# Altium schematic sheet 3_03 Power.SchDoc.schdoc
size 497 x 243 mm; Name: A_A4; Symbol: A_A4; Device: A_A4; @Project Name: 03 Power.SchDoc; REV: 1.0; Date: 2024-05-14; Sheet: 1/1; Draw By: TheConquerK; Company: NEU-REAL-LAB; Convert to PCB: yes; Add into BOM: yes
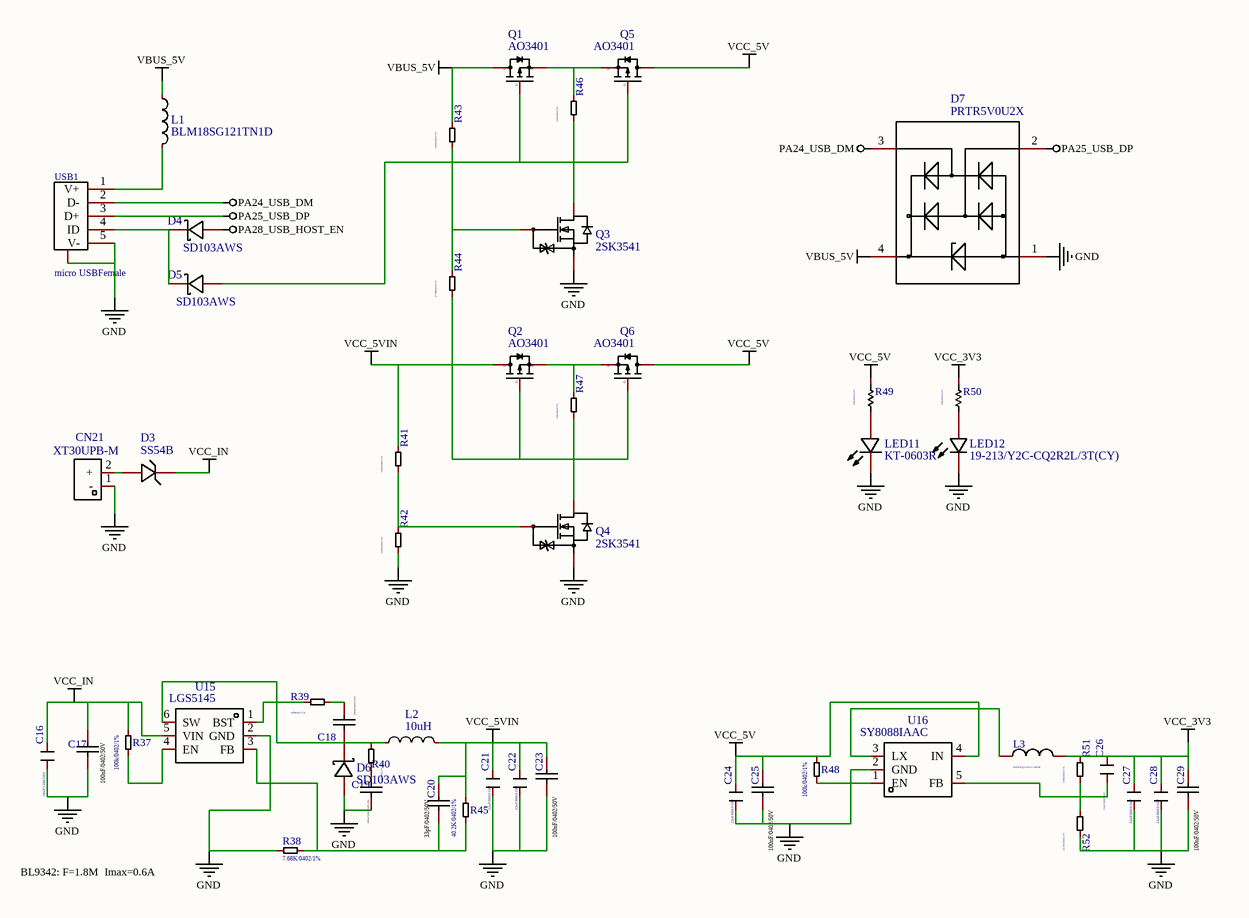
[diagram p0: 3_03 Power.SchDoc.schdoc]

## Parts
C16  10uF/1206/50V  [C1206]
C17  100nF/0603/50V  [C0402]  (value not drawn)
C18  100nF/0603/50V  [C0402]  (value not drawn)
C19  100nF/0603/50V  [C0402]  (value not drawn)
C20  100nF/0603/50V  [R0402]  (value not drawn)
C21  22uF/0603/10V  [C0603]
C22  22uF/0603/10V  [C0603]
C23  100nF/0603/50V  [C0402]  (value not drawn)
C24  22uF/0603/10V  [C0603]
C25  100nF/0603/50V  [C0402]  (value not drawn)
C26  22pF/0402/50V  [C0402]
C27  22uF/0603/10V  [C0603]
C28  22uF/0603/10V  [C0603]
C29  100nF/0603/50V  [C0402]  (value not drawn)
CN21  XT30UPB-M  [CONN-TH_XT30UPB-M]
D3  SS54B  [DO-214BA_L4.8-W2.9-LS5.3-RD]
D4  SD103AWS  [SOD-323_L1.8-W1.3-LS2.5-RD]
D5  SD103AWS  [SOD-323_L1.8-W1.3-LS2.5-RD]
D6  SD103AWS  [SOD-323_L1.8-W1.3-LS2.5-RD]
D7  PRTR5V0U2X  [SOT-143_L2.9-W1.3-P1.92-LS2.3-BL]
L1  BLM18SG121TN1D  [L0603]
L2  10uH  [L1008]
L3  PSPNAQ252012-2R2M  [L2520]
LED11  KT-0603R  [LED0603-RD]
LED12  19-213/Y2C-CQ2R2L/3T(CY)  [LED0603-RD-YELLOW]
Q1  AO3401  [SOT-23-3_L2.9-W1.3-P1.90-LS2.4-BR]
Q2  AO3401  [SOT-23-3_L2.9-W1.3-P1.90-LS2.4-BR]
Q3  2SK3541  [SOT-723_L1.2-W0.8-P0.40-LS1.2-BR]
Q4  2SK3541  [SOT-723_L1.2-W0.8-P0.40-LS1.2-BR]
Q5  AO3401  [SOT-23-3_L2.9-W1.3-P1.90-LS2.4-BR]
Q6  AO3401  [SOT-23-3_L2.9-W1.3-P1.90-LS2.4-BR]
R37  100k/0402/1%  [R0402]
R38  7.68K/0402/1%  [R0402]
R39  10R/0402/1%  [R0402]
R40  10R/0402/1%-NC  [R0402]
R41  100k/0402/1%  [R0402]
R42  100k/0402/1%  [R0402]
R43  100k/0402/1%  [R0402]
R44  470R/0402/1%  [R0402]
R45  40.2K/0402/1%  [R0402]
R46  10k/0402/1%  [R0402]
R47  10k/0402/1%  [R0402]
R48  100k/0402/1%  [R0402]
R49  10K/0402/1%  [R0402]
R50  10K/0402/1%  [R0402]
R51  100k/0402/1%  [R0402]
R52  22.1K/0402/1%  [R0402]
U15  LGS5145  [SOT-23-6_L2.9-W1.7-P0.95-LS2.8-BL]
U16  SY8088IAAC  [SOT-23-5_L3.0-W1.7-P0.95-LS2.8-BL]
USB1  micro USBFemale  [MICRO-USB-SMD_5P-P0.65-H-F_C10418]

## Nets
GND: C16.1 C17.1 C19.1 C21.1 C22.1 C23.1 C24.1 C25.1 C27.1 C28.1 C29.1 CN21.1(-) D6.2(A) D7.1(GND) LED11.1(K) LED12.1(C) Q3.2(S) Q4.2(S) R38.2 R42.1 R52.1 U15.2(GND) U16.2(GND) USB1.5(MTN)
PA24_USB_DM: D7.3(IO2) USB1.2(D-)
PA25_USB_DP: D7.2(IO1) USB1.3(D+)
PA28_USB_HOST_EN: D4.2(A)
VBUS_5V: D7.4(VCC) L1.1 Q1.3(D) R43.2
VCC_3V3: C26.2 C27.2 C28.2 C29.2 L3.2 R50.2 R51.2
VCC_5V: C24.2 C25.2 Q5.3(D) Q6.3(D) R48.2 R49.2 U16.4(IN)
VCC_5VIN: C20.2 C21.2 C22.2 C23.2 L2.2 Q2.3(D) R41.2 R45.2
VCC_IN: C16.2 C17.2 D3.1(C) R37.2 U15.5(VIN)
NetC18_1: C18.1 D6.1(K) L2.1 R40.2 U15.6(SW)
NetC18_2: C18.2 R39.2
NetC19_2: C19.2 R40.1
NetC20_1: C20.1 R38.1 R45.1 U15.3(FB)
NetC26_1: C26.1 R51.1 R52.2 U16.5(FB)
NetCN21_2: CN21.2(+) D3.2(A)
NetD4_1: D4.1(K) D5.1(K) USB1.4(ID)
NetD5_2: D5.2(A) Q1.1(G) Q3.3(D) Q5.1(G) R46.1
NetL1_2: L1.2 USB1.1(V+)
NetL3_1: L3.1 U16.3(LX)
NetLED11_2: LED11.2(A) R49.1
NetLED12_2: LED12.2(A) R50.1
NetQ1_2: Q1.2(S) Q5.2(S) R46.2
NetQ2_1: Q2.1(G) Q4.3(D) Q6.1(G) R44.1 R47.1
NetQ2_2: Q2.2(S) Q6.2(S) R47.2
NetQ3_1: Q3.1(G) R43.1 R44.2
NetQ4_1: Q4.1(G) R41.1 R42.2
NetR37_1: R37.1 U15.4(EN)
NetR39_1: R39.1 U15.1(BST)
NetR48_1: R48.1 U16.1(EN)

## Notes on the sheet
- BL9342: F=1.8M  Imax=0.6A
- 1
- 2
- 3
- 4
- 5
- A
- B
- C
- D
- TITLE:
- 03 Power.SchDoc
- REV:
- 1.0
- Date:
- Company:
- 2024-05-14
- NEU-REAL-LAB
- Drawn By:
- TheConquerK
- Sheet:
- 1/1
- (in symbol 100nF/0603/50V) 100nF/0402/50V; 100nF/0402/50V-NC; 33pF/0402/50V

## Library data of the parts
C16 = 10uF/1206/50V: Convert to PCB: yes; Name: 10uF/1206/50V; Symbol: 10uF/1206/50V; Device: 10uF/1206/50V; Add into BOM: yes; Origin Footprint: C1206
C17-C20 C23 C25 C29 = 100nF/0603/50V: Convert to PCB: yes; Name: 100nF/0603/50V; Symbol: 100nF/0603/50V; Device: 100nF/0603/50V; Published: 8-Jun-2000; LatestRevisionDate: 17-Jul-2002; LatestRevisionNote: Re-released for DXP Platform.; PackageReference: RAD-0.3; Publisher: Altium Limited; PackageDescription: Radial Cap, Thru-Hole; 2 Leads; 0.3 in Pin Spacing; Add into BOM: yes
  C17-C19 C23 C25 C29: Origin Footprint: C0402
  C20: Origin Footprint: R0402
C21 C22 C24 C27 C28 = 22uF/0603/10V: Convert to PCB: yes; Name: 22uF/0603/10V; Symbol: 22uF/0603/10V; Device: 22uF/0603/10V; Add into BOM: yes; Origin Footprint: C0603
C26 = 22pF/0402/50V: Convert to PCB: yes; Name: 22pF/0402/50V; Symbol: 22pF/0402/50V; Device: 22pF/0402/50V; Add into BOM: yes; Origin Footprint: C0402
CN21 = XT30UPB-M: Manufacturer: AMASS(艾迈斯); Convert to PCB: yes; Name: XT30UPB-M; Symbol: XT30UPB-M; Device: XT30UPB-M; Supplier: LCSC; Supplier Part: C428721; Manufacturer Part: XT30UPB-M; JLCPCB Part Class: Extended Part; Add into BOM: yes; Origin Footprint: CONN-TH_XT30UPB-M
D3 = SS54B: Manufacturer: PINGWEI(平伟); Convert to PCB: yes; Name: SS54B; Symbol: SS54B; Device: SS54B; Supplier: LCSC; Supplier Part: C360458; Manufacturer Part: SS54B; JLCPCB Part Class: Extended Part; Add into BOM: yes; Origin Footprint: DO-214BA_L4.8-W2.9-LS5.3-RD
D4-D6 = SD103AWS: Manufacturer: 星海; Convert to PCB: yes; Name: SD103AWS; Symbol: SD103AWS; Device: SD103AWS; Supplier: LCSC; Supplier Part: C146260; Manufacturer Part: SD103AWS; JLCPCB Part Class: Extended Part; Add into BOM: yes; Origin Footprint: SOD-323_L1.8-W1.3-LS2.5-RD
D7 = PRTR5V0U2X: Manufacturer: Yenji Elec; Convert to PCB: yes; Name: PRTR5V0U2X; Symbol: PRTR5V0U2X; Device: PRTR5V0U2X; Supplier: LCSC; Supplier Part: C330092; Manufacturer Part: PRTR5V0U2X; Add into BOM: yes; Origin Footprint: SOT-143_L2.9-W1.3-P1.92-LS2.3-BL
L1 = BLM18SG121TN1D: Manufacturer: muRata(村田); Convert to PCB: yes; Name: BLM18SG121TN1D; Symbol: BLM18SG121TN1D; Device: BLM18SG121TN1D; Supplier: LCSC; Supplier Part: C113030; Manufacturer Part: BLM18SG121TN1D; JLCPCB Part Class: Extended Part; Add into BOM: yes; Origin Footprint: L0603
L2 = 10uH: Manufacturer: Sunlord(顺络); Manufacturer Part: MPL2520S100MWT; Convert to PCB: yes; Name: 10uH; Symbol: 10uH; Device: 10uH; Supplier: LCSC; Supplier Part: C370039; JLCPCB Part Class: Extended Part; Add into BOM: yes; Origin Footprint: L1008
L3 = PSPNAQ252012-2R2M: Convert to PCB: yes; Name: PSPNAQ252012-2R2M; Symbol: PSPNAQ252012-2R2M; Device: PSPNAQ252012-2R2M; Add into BOM: yes; Origin Footprint: L2520
LED11 = KT-0603R: Manufacturer: KENTO; Convert to PCB: yes; Name: KT-0603R; Symbol: KT-0603R; Device: KT-0603R; Supplier: LCSC; Manufacturer Part: KT-0603R; Supplier Part: C2286; JLCPCB Part Class: Basic Part; Add into BOM: yes; Origin Footprint: LED0603-RD
LED12 = 19-213/Y2C-CQ2R2L/3T(CY): Manufacturer: EVERLIGHT(亿光); Convert to PCB: yes; Name: 19-213/Y2C-CQ2R2L/3T(CY); Symbol: 19-213/Y2C-CQ2R2L/3T(CY); Device: 19-213/Y2C-CQ2R2L/3T(CY); Supplier: LCSC; Manufacturer Part: 19-213/Y2C-CQ2R2L/3T(CY); Supplier Part: C72038; JLCPCB Part Class: Basic Part; Add into BOM: yes; Origin Footprint: LED0603-RD-YELLOW
Q1 Q2 Q5 Q6 = AO3401: Manufacturer: Hottech(合科泰); Convert to PCB: yes; Name: AO3401; Symbol: AO3401; Device: AO3401; Supplier: LCSC; Manufacturer Part: AO3401; Supplier Part: C181091; JLCPCB Part Class: Extended Part; Add into BOM: yes; Origin Footprint: SOT-23-3_L2.9-W1.3-P1.90-LS2.4-BR
Q3 Q4 = 2SK3541: Manufacturer: CJ（江苏长电/长晶）; Convert to PCB: yes; Name: 2SK3541; Symbol: 2SK3541; Device: 2SK3541; Supplier: LCSC; Supplier Part: C504051; Manufacturer Part: 2SK3541; JLCPCB Part Class: Extended Part; Add into BOM: yes; Origin Footprint: SOT-723_L1.2-W0.8-P0.40-LS1.2-BR
R37 R41-R43 R48 R51 = 100k/0402/1%: Convert to PCB: yes; Name: 100k/0402/1%; Symbol: 100k/0402/1%; Device: 100k/0402/1%; Add into BOM: yes; Origin Footprint: R0402
R38 = 7.68K/0402/1%: Convert to PCB: yes; Name: 7.68K/0402/1%; Symbol: 7.68K/0402/1%; Device: 7.68K/0402/1%; Add into BOM: yes; Origin Footprint: R0402
R39 = 10R/0402/1%: Convert to PCB: yes; Name: 10R/0402/1%; Symbol: 10R/0402/1%; Device: 10R/0402/1%; Add into BOM: yes; Origin Footprint: R0402
R40 = 10R/0402/1%-NC: Convert to PCB: yes; Name: 10R/0402/1%-NC; Symbol: 10R/0402/1%-NC; Device: 10R/0402/1%-NC; Add into BOM: yes; Origin Footprint: R0402
R44 = 470R/0402/1%: Convert to PCB: yes; Name: 470R/0402/1%; Symbol: 470R/0402/1%; Device: 470R/0402/1%; Add into BOM: yes; Origin Footprint: R0402
R45 = 40.2K/0402/1%: Convert to PCB: yes; Name: 40.2K/0402/1%; Symbol: 40.2K/0402/1%; Device: 40.2K/0402/1%; Add into BOM: yes; Origin Footprint: R0402
R46 R47 = 10k/0402/1%: Convert to PCB: yes; Name: 10k/0402/1%; Symbol: 10k/0402/1%; Device: 10k/0402/1%; Add into BOM: yes; Origin Footprint: R0402
R49 R50 = 10K/0402/1%: Convert to PCB: yes; Name: 10K/0402/1%; Symbol: 10K/0402/1%; Device: 10K/0402/1%; Published: 8-Jun-2000; LatestRevisionDate: 17-Jul-2002; LatestRevisionNote: Re-released for DXP Platform.; PackageReference: AXIAL-0.5; Publisher: Altium Limited; PackageDescription: Axial Device, Thru-Hole; 2 Leads; 0.5 in Pin Spacing; Add into BOM: yes; Origin Footprint: R0402
R52 = 22.1K/0402/1%: Convert to PCB: yes; Name: 22.1K/0402/1%; Symbol: 22.1K/0402/1%; Device: 22.1K/0402/1%; Add into BOM: yes; Origin Footprint: R0402
U15 = LGS5145: Manufacturer: Legend-Si(棱晶半导体); Convert to PCB: yes; Name: LGS5145; Symbol: LGS5145; Device: LGS5145; Supplier: LCSC; Supplier Part: C5123971; Manufacturer Part: LGS5145; link: https://atta.szlcsc.com/upload/public/pdf/source/20220805/2DB5B167BD44FCFE8FA85A20D08C0087.pdf; JLCPCB Part Class: Extended Part; Add into BOM: yes; Origin Footprint: SOT-23-6_L2.9-W1.7-P0.95-LS2.8-BL
U16 = SY8088IAAC: Manufacturer: silergy(矽力杰); Convert to PCB: yes; Name: SY8088IAAC; Symbol: SY8088IAAC; Device: SY8088IAAC; Supplier: LCSC; Supplier Part: C479072; Manufacturer Part: SY8088IAAC; JLCPCB Part Class: Extended Part; Add into BOM: yes; Origin Footprint: SOT-23-5_L3.0-W1.7-P0.95-LS2.8-BL
USB1 = micro USBFemale: Manufacturer: ValuePro; Convert to PCB: yes; Name: micro USBFemale; Symbol: micro USBFemale; Device: micro USBFemale; Supplier: LCSC; Manufacturer Part: micro USBFemale; Supplier Part: C10418; JLCPCB Part Class: Extended Part; Add into BOM: yes; Origin Footprint: MICRO-USB-SMD_5P-P0.65-H-F_C10418